# EasyEDA Pro project STM32H723ZGTx_ADDA.eprj, board PCB1
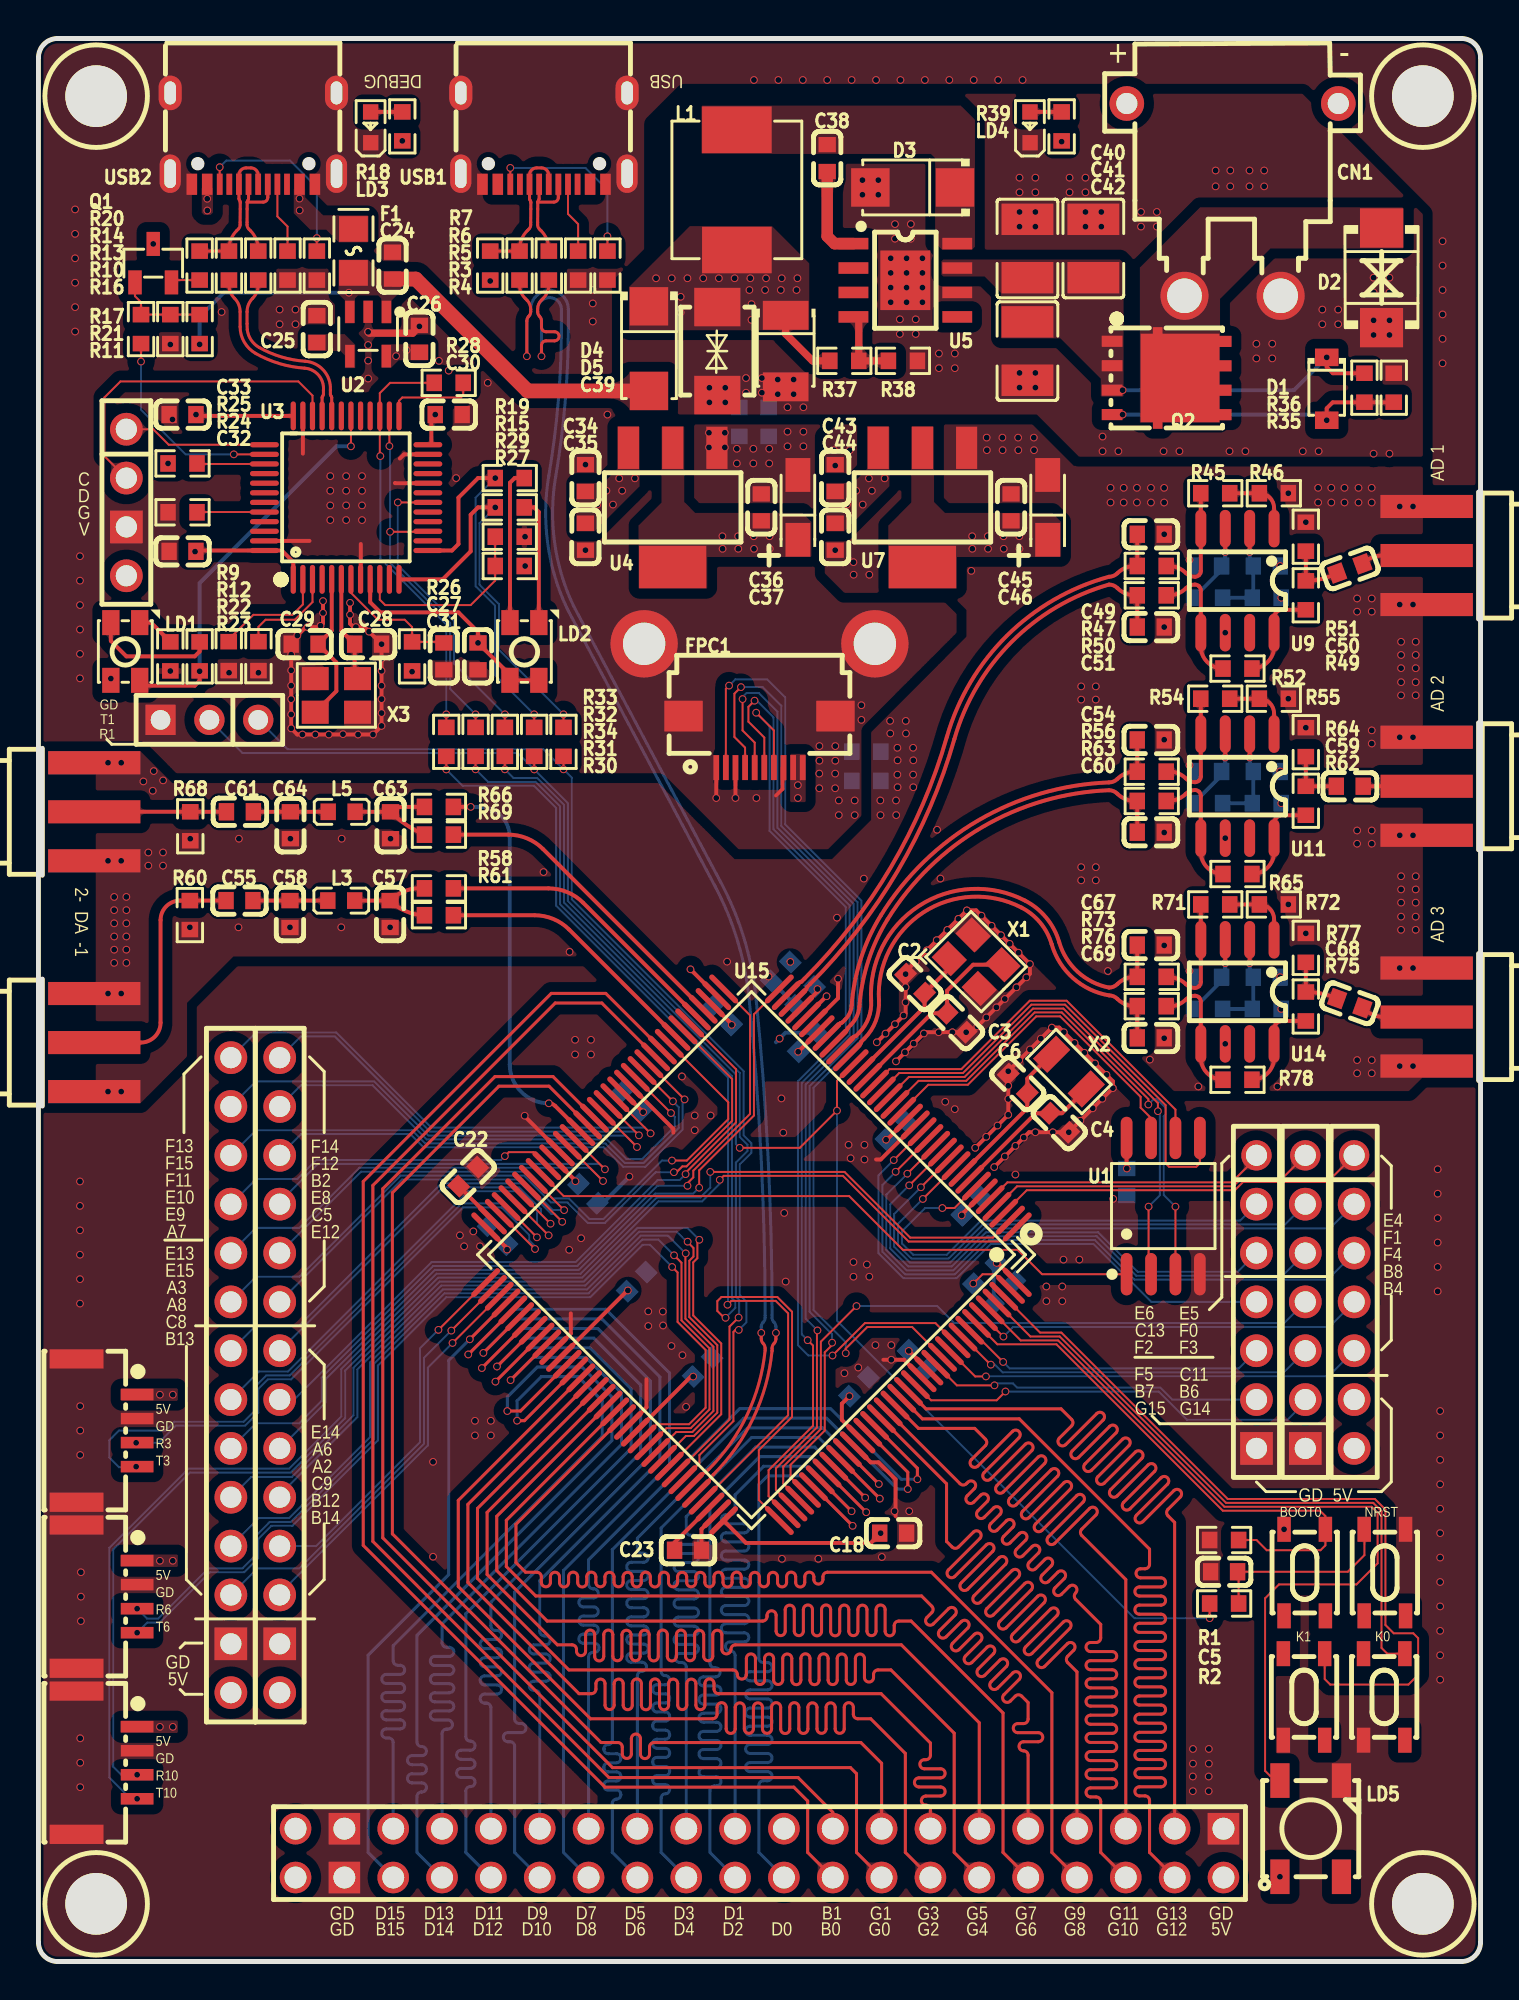
[diagram p5: board, top side]
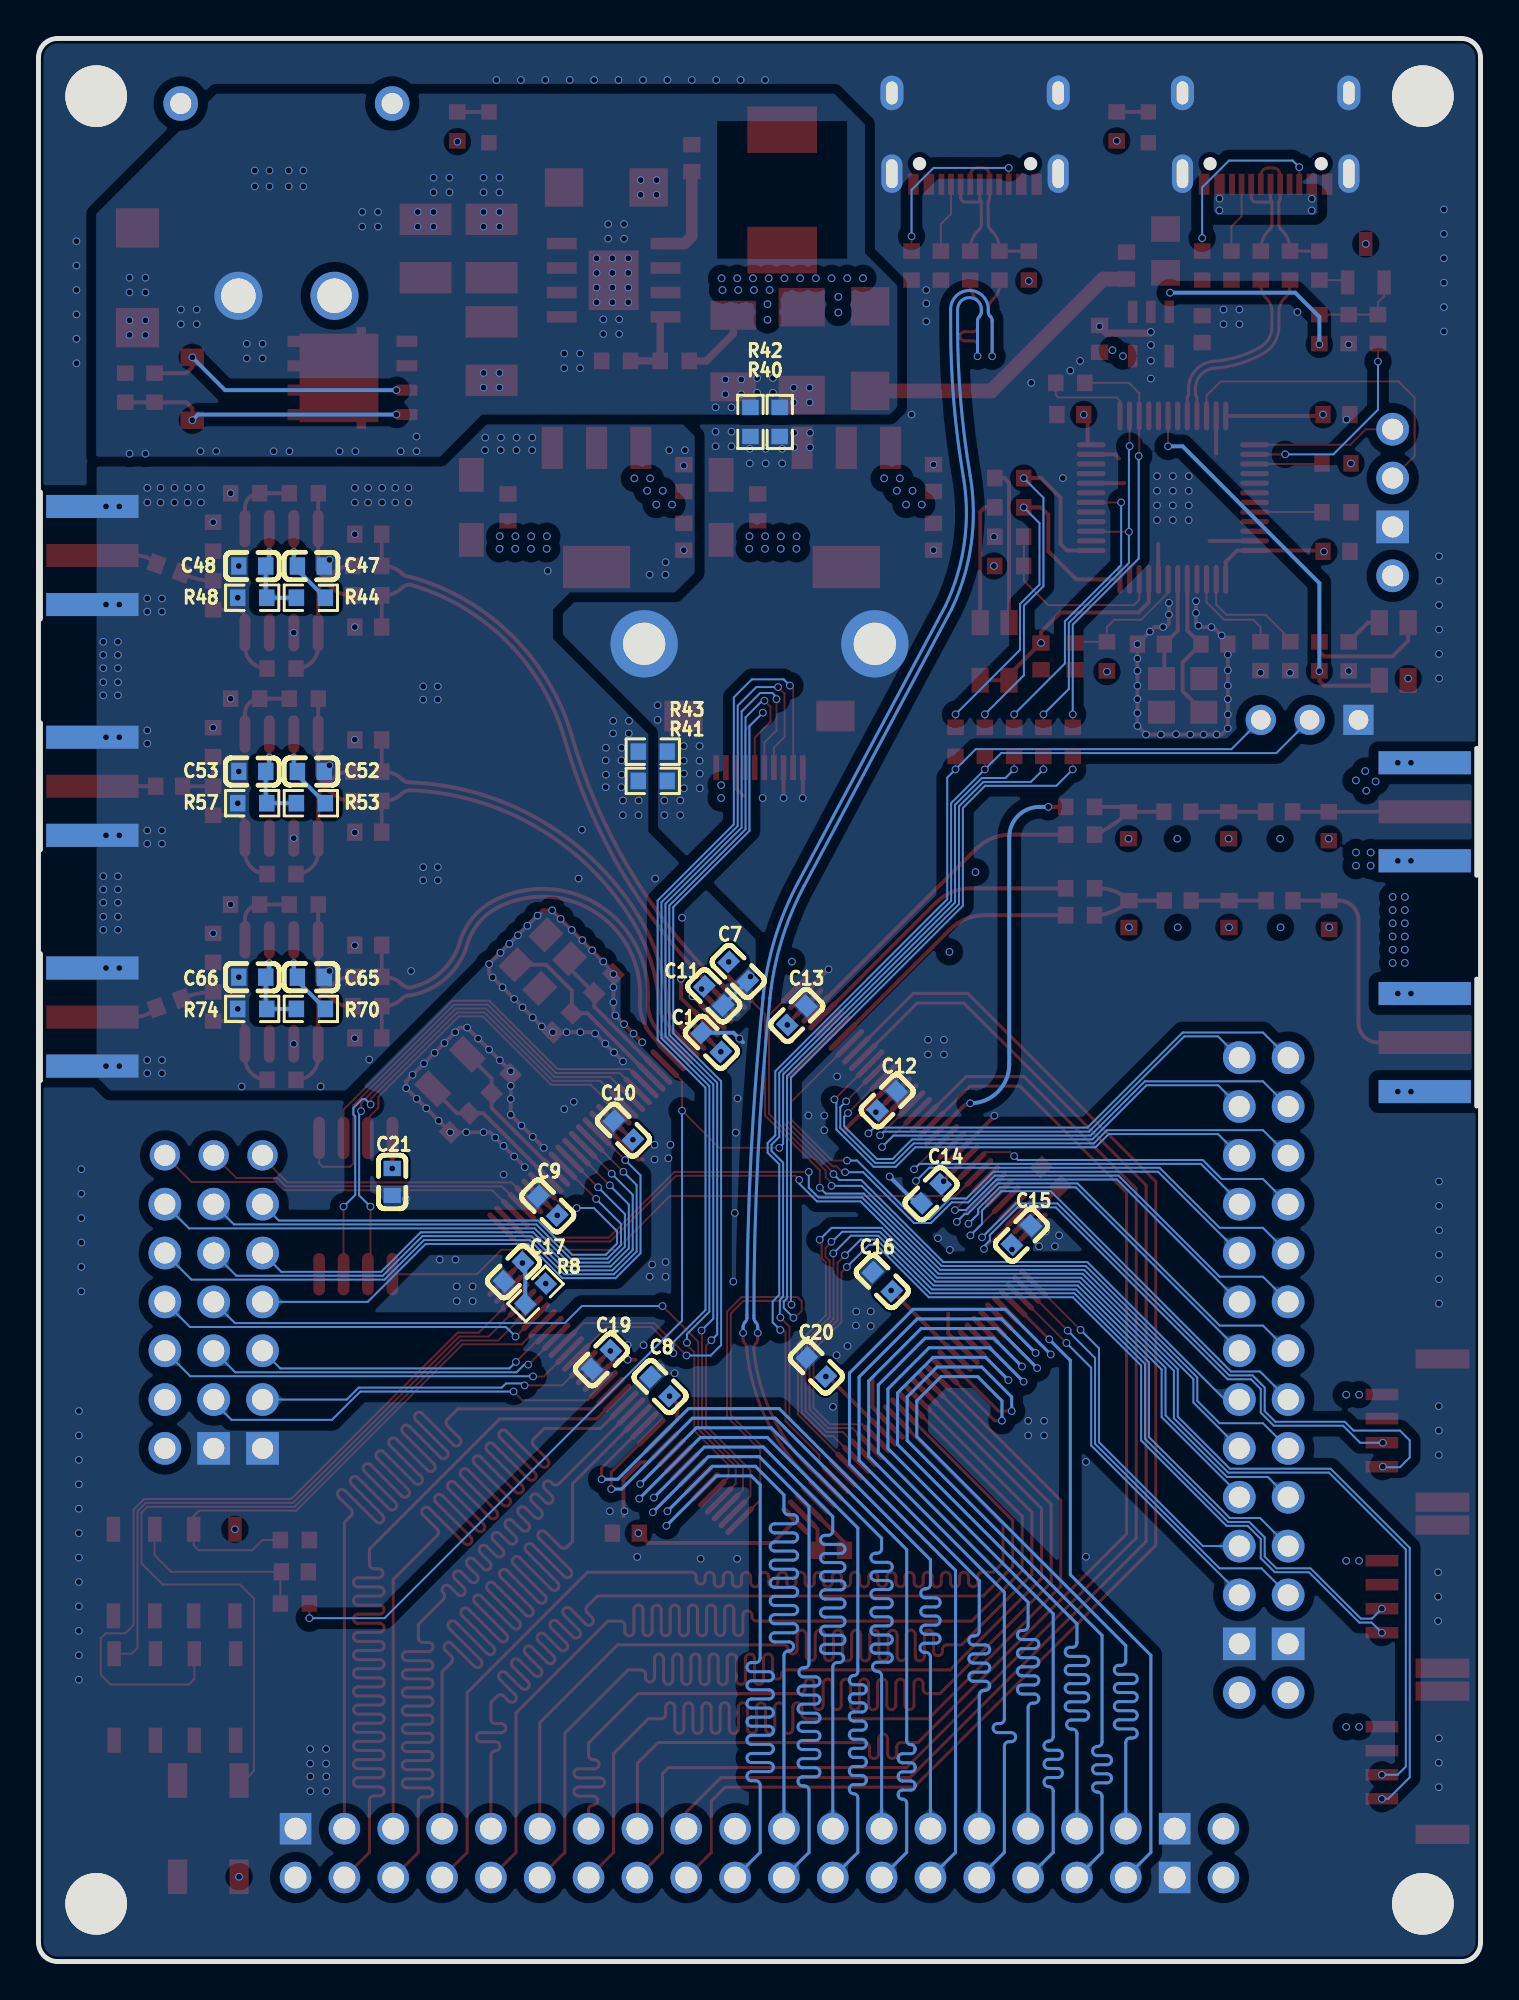
[diagram p6: board, bottom side, seen from below]

Outline 75 x 100 mm; copper layers: Top Layer, GND, PWR, Bottom Layer. Coordinates in mm from the lower left corner of the outline.
Outline path: 0,99 0,1 arc(0.29,0.29) 1,0 74,0 arc(74.71,0.29) 75,1 75,99 arc(74.71,99.71) 74,100 1,100 arc(0.29,99.71) 0,99
Stack: Top Layer 0.035mm 外层铜厚1oz / Dielectric1 0.0994mm 3313 RC57% 4.2mil / GND 0.0152mm 内层铜厚 / Dielectric2 1.265mm 1.3mm H/HOZ Copper / PWR 0.0152mm 内层铜厚 / Dielectric3 0.0994mm 3313 RC57% 4.2mil / Bottom Layer 0.035mm 外层铜厚1oz

## Design rules (mm)
net PA12: DP2
net LK_USB_M: DP3
net LK_USB_P: DP3
net PA11: DP2
net DA0: ADC
net DA1: ADC
net DB8: DAC
net DB9: DAC
net DB10: DAC
net DB11: DAC
net DB12: DAC
net DB13: DAC
net DA2: ADC
net DA3: ADC
net DA4: ADC
net DA5: ADC
net DA6: ADC
net DA7: ADC
net DA8: ADC
net DB0: DAC
net DB1: DAC
net DB2: DAC
net DB3: DAC
net DB4: DAC
net DB5: DAC
net DB6: DAC
net DB7: DAC
net DA9: ADC
net DA10: ADC
net DA11: ADC
net DA12: ADC
net DA13: ADC
net DA14: ADC
net DA15: ADC
net ADC_CLK: ADC
net DAC_CLK: DAC
net ADC_DCO: ADC
net ADC2_INP10: DP8
net ADC2_INN10: DP8
net ADC3_INN1: DP7
net ADC3_INP1: DP7
net ADC1_INP16: DP6
net ADC1_INN16: DP6
net DAOF: ADC
template: 自定义配置
spacing copperThickness1oz (default): track to track 0.102, other pairs 0.152 to 0.3
spacing copperThickness2oz: track to track 0.203, other pairs 0.152 to 0.3
spacing ADDA: track to track 0.315, other pairs 0.152 to 0.3
track width copperThickness1oz (default): min 0.102, default 0.102, max 2.54
track width copperThickness2oz: min 0.203, default 0.203, max 2.54
track width 50om: min 0.127, default 0.157, max 2.54
track width VDD: min 0.102, default 0.203, max 2.54
differential pair differentialPair (default): width min 0.127, default 0.203, max 2.54; gap min 0.152, default 0.203
differential pair USB_90om_df_8mil: width min 0.127, default 0.157, max 2.54; gap min 0.203, default 0.203
via viaSize (default): diameter min 0.399, default 0.399, max 10; hole min 0.3, default 0.305, max 6.299
net class ADC uses 50om, ADDA
net class DAC uses 50om, ADDA
net AVDD uses VDD
net AGND uses VDD
net GND uses VDD
net DVDD uses VDD
net LK_3V3 uses VDD
net PA12 uses USB_90om_df_8mil
net LK_USB_M uses USB_90om_df_8mil
net LK_USB_P uses USB_90om_df_8mil
net PA11 uses USB_90om_df_8mil
net DA0 uses 50om, ADC_len, ADDA
net DA1 uses 50om, ADC_len, ADDA
net DB8 uses 50om, ADDA, DAC_len
net DB9 uses 50om, ADDA, DAC_len
net DB10 uses 50om, ADDA, DAC_len
net DB11 uses 50om, ADDA, DAC_len
net DB12 uses 50om, ADDA, DAC_len
net DB13 uses 50om, ADDA, DAC_len
net DA2 uses 50om, ADC_len, ADDA
net DA3 uses 50om, ADC_len, ADDA
net DA4 uses 50om, ADC_len, ADDA
net DA5 uses 50om, ADC_len, ADDA
net DA6 uses 50om, ADC_len, ADDA
net DA7 uses 50om, ADC_len, ADDA
net DA8 uses 50om, ADC_len, ADDA
net DB0 uses 50om, ADDA, DAC_len
net DB1 uses 50om, ADDA, DAC_len
net DB2 uses 50om, ADDA, DAC_len
net DB3 uses 50om, ADDA, DAC_len
net DB4 uses 50om, ADDA, DAC_len
net DB5 uses 50om, ADDA, DAC_len
net DB6 uses 50om, ADDA, DAC_len
net DB7 uses 50om, ADDA, DAC_len
net DA9 uses 50om, ADC_len, ADDA
net DA10 uses 50om, ADC_len, ADDA
net DA11 uses 50om, ADC_len, ADDA
net DA12 uses 50om, ADC_len, ADDA
net DA13 uses 50om, ADC_len, ADDA
net DA14 uses 50om, ADC_len, ADDA
net DA15 uses 50om, ADC_len, ADDA
net ADC_CLK uses 50om, ADDA
net DAC_CLK uses 50om, ADDA
net ADC_DCO uses 50om, ADDA
net DAOF uses 50om, ADDA
diff pair DP2 uses USB_90om_df_8mil
diff pair DP3 uses USB_90om_df_8mil
eq len grp ADC_DATA uses ADC_len
eq len grp DAC_DATA uses DAC_len

## Placement (name value [footprint] x y rotation side)
C1  100nF  [C0603]  39.88 50.22 45 bottom
C2  22pF  [C0603]  45.59 50.85 135 top
C3  22pF  [C0603]  47.75 48.82 315 top
C4  22pF  [C0603]  53.09 43.62 135 top
C5  100nF  [C0603]  61.66 20.27 0 top
C6  22pF  [C0603]  50.93 45.65 315 top
C7  100nF  [C0603]  38.61 51.49 45 bottom
C8  100nF  [C0603]  42.67 29.9 225 bottom
C9  100nF  [C0603]  48.51 39.29 225 bottom
C10  100nF  [C0603]  44.58 43.23 225 bottom
C11  100nF  [C0603]  40 47.8 225 bottom
C12  100nF  [C0603]  30.86 44.75 315 bottom
C13  100nF  [C0603]  35.56 49.2 315 bottom
C14  100nF  [C0603]  28.57 39.93 135 bottom
C15  100nF  [C0603]  23.88 37.77 315 bottom
C16  100nF  [C0603]  31.12 35.36 225 bottom
C17  100nF  [C0603]  50.29 35.86 135 bottom
C18  100nF  [C0603]  44.45 22.28 180 top
C19  100nF  [C0603]  45.72 31.29 135 bottom
C20  1uF  [C0603]  34.54 30.91 225 bottom
C21  100nF  [C0603]  56.6 40.54 90 bottom
C22  2.2uF  [C0603]  22.35 40.82 45 top
C23  2.2uF  [C0603]  33.78 21.39 0 top
C24  1uF  [C0603]  18.41 88.19 270 top
C25  22nF  [C0603]  14.48 84.89 270 top
C26  1uF  [C0603]  19.81 84.38 270 top
C27  100nF  [C0603]  21.08 67.87 90 top
C28  22pF  [C0603]  17.14 68.5 0 top
C29  22pF  [C0603]  13.84 68.5 180 top
C30  100nF  [C0603]  21.34 80.44 180 top
C31  100nF  [C0603]  22.86 67.87 90 top
C32  100nF  [C0603]  7.49 73.33 0 top
C33  100nF  [C0603]  7.49 80.44 0 top
C34  100nF  [C0603]  28.45 77.14 270 top
C35  1uF  [C0603]  28.45 74.09 90 top
C36  1uF  [C0603]  37.59 75.62 270 top
C37  10uF  [CAP-SMD_L3.2-W1.6-RD-C7171]  39.5 75.62 90 top
C38  10nF  [C0603]  41.02 93.78 270 top
C39  220uF  [CASE-B_3528]  38.86 83.74 270 top
C40  4.7uF  [C1210]  51.44 89.08 270 top
C41  4.7uF  [C1210]  54.86 89.08 270 top
C42  4.7uF  [C1210]  51.44 83.74 90 top
C43  100nF  [C0603]  41.44 77.14 270 top
C44  1uF  [C0603]  41.44 74.09 90 top
C45  1uF  [C0603]  50.58 75.62 270 top
C46  10uF  [CAP-SMD_L3.2-W1.6-RD-C7171]  52.49 75.62 90 top
C47  100nF  [C0603]  60.83 72.57 0 bottom
C48  100nF  [C0603]  63.88 72.57 0 bottom
C49  100nF  [C0603]  57.85 74.22 180 top
C50  100nF  [C0603]  68.2 72.44 200 top
C51  100nF  [C0603]  57.85 69.39 180 top
C52  100nF  [C0603]  60.83 61.88 0 bottom
C53  100nF  [C0603]  63.88 61.88 0 bottom
C54  100nF  [C0603]  57.85 63.52 180 top
C55  104  [C0603]  10.45 55.17 180 top
C57  110p  [C0603]  18.29 54.47 90 top
C58  120p  [C0603]  13.08 54.47 90 top
C59  100nF  [C0603]  68.2 61.12 180 top
C60  100nF  [C0603]  57.85 58.72 180 top
C61  104  [C0603]  10.48 59.79 180 top
C63  110p  [C0603]  18.31 59.09 90 top
C64  120p  [C0603]  13.1 59.09 90 top
C65  100nF  [C0603]  60.83 51.19 0 bottom
C66  100nF  [C0603]  63.88 51.19 0 bottom
C67  100nF  [C0603]  57.85 52.86 180 top
C68  100nF  [C0603]  68.2 49.83 160 top
C69  100nF  [C0603]  57.85 48.03 180 top
CN1  XT30PW-M30.G.Y  [CONN-TH_XT30PW-M]  62.1 91.62 180 top
D1  BZT52C9V1  [SOD-123_L2.7-W1.6-LS3.7-RD]  67 81.78 270 top
D2  SMBJ24CA  [SMB_L4.6-W3.6-LS5.4-BI]  69.85 87.55 90 top
D3  B340A  [SMA_L4.3-W2.6-LS5.1-RD]  45.47 92.25 180 top
D4  B340A  [SMA_L4.3-W2.6-LS5.1-RD]  31.75 83.87 270 top
D5  SMBJ5.0CA  [SMB_L4.5-W3.6-LS5.2-BI]  35.31 83.74 90 top
F1  BSMD0805-100-6V  [F0805]  16.38 88.95 270 top
FPC1  AFC01-S10FCA-00  [FPC-SMD_P0.5-10P_FGS-XJ-H2.0]  37.5 63.42 0 top
H1  -  [HDR-TH_4P-P2.54-V-F]  4.57 75.87 270 top
H2  -  [HDR-TH_3P-P2.54-V-F]  8.89 64.57 180 top
H3  -  [HDR-TH_14P-P2.54-V-F-1]  10.01 30.49 270 top
H4  -  [HDR-TH_14P-P2.54-V-F-1]  12.55 30.49 270 top
H5  -  [HDR-TH_7P-P2.54-V-F#2]  63.35 34.3 270 top
H6  -  [HDR-TH_7P-P2.54-V-F#2]  65.89 34.3 270 top
H7  -  [HDR-TH_7P-P2.54-V-F]  68.43 34.3 270 top
L1  22uH  [IND-SMD_L7.0-W6.6_FXL0630]  36.32 92.13 270 top
L3  300n  [L0603]  15.75 55.17 180 top
L5  300n  [L0603]  15.77 59.79 180 top
LD1  XL-3528SURUGC  [LED-SMD_4P-L3.2-W2.8-LS3.5-TL]  4.52 68.12 270 top
LD2  XL-3528SURUGC  [LED-SMD_4P-L3.2-W2.8-LS3.5-TL]  25.27 68.12 270 top
LD3  -  [LED_0603]  17.27 95.43 90 top
LD4  -  [LED_0603]  51.56 95.43 90 top
LD5  WS2812B-V5/W  [LED-SMD_4P-L5.0-W5.0-TL-1]  66.17 6.91 90 top
NOREF  -  [Pad_e3]  43.5 68.52 180 top
NOREF#2  -  [Pad_e10]  31.5 68.52 180 top
Q1  MMS8050-H-TP  [SOT-23-3_L2.9-W1.3-P1.90-LS2.4-BR]  5.97 88.32 270 top
Q2  HYG110P04LQ2C2  [PDFN-8_L5.2-W5.9-P1.27-LS6.2-BL]  58.67 82.35 270 top
R1  10K  [R0603]  61.66 21.92 180 top
R2  10K  [R0603]  61.66 18.62 180 top
R3  5.1K  [R0603]  28.07 88.19 90 top
R4  5.1K  [R0603]  29.59 88.19 90 top
R5  22R  [R0603]  26.54 88.19 90 top
R6  22R  [R0603]  25.02 88.19 90 top
R7  1.5K  [R0603]  23.5 88.19 90 top
R8  10K  [R0603]  49.15 34.72 315 bottom
R9  100R  [R0603]  6.86 67.87 90 top
R10  5.1K  [R0603]  12.95 88.19 90 top
R11  10K  [R0603]  8.38 84.89 270 top
R12  100R  [R0603]  8.38 67.87 90 top
R13  22R  [R0603]  11.43 88.19 270 top
R14  22R  [R0603]  9.91 88.19 270 top
R15  100R  [R0603]  24.51 75.62 0 top
R16  5.1K  [R0603]  14.48 88.19 90 top
R17  100R  [R0603]  5.33 84.89 270 top
R18  1K  [R0603]  18.92 95.43 90 top
R19  100R  [R0603]  24.51 77.14 0 top
R20  1.5K  [R0603]  8.38 88.19 270 top
R21  36K  [R0603]  6.86 84.89 90 top
R22  10K  [R0603]  9.89 67.88 270 top
R23  10K  [R0603]  11.44 67.88 270 top
R24  100K  [R0603]  7.49 75.36 0 top
R25  4.7K  [R0603]  7.49 77.9 180 top
R26  100K  [R0603]  19.43 67.87 270 top
R27  4.7K  [R0603]  24.51 72.57 0 top
R28  100R  [R0603]  21.34 82.09 0 top
R29  4.7K  [R0603]  24.51 74.09 180 top
R30  22R  [R0603]  27.31 63.42 270 top
R31  22R  [R0603]  25.78 63.42 270 top
R32  22R  [R0603]  22.73 63.42 270 top
R33  22R  [R0603]  21.21 63.42 270 top
R34  22R  [R0603]  24.26 63.42 270 top
R35  10K  [R0603]  70.49 81.84 270 top
R36  10K  [R0603]  68.96 81.84 90 top
R37  10K 0.1%  [R0603]  41.91 83.24 180 top
R38  3.24K 0.1%  [R0603]  44.96 83.24 180 top
R39  1K  [R0603]  53.21 95.43 90 top
R40  0R  [R0603]  37.97 80.06 270 bottom
R41  0R  [R0603]  43.05 61.39 0 bottom
R42  0R  [R0603]  36.45 80.06 270 bottom
R43  0R  [R0603]  43.05 62.92 0 bottom
R44  10K 0.1%  [R0603]  60.83 70.92 180 bottom
R45  499R  [R0603]  61.2 76.35 180 top
R46  523R  [R0603]  64.25 76.35 180 top
R47  49.9R  [R0603]  57.9 72.57 180 top
R48  10K 0.1%  [R0603]  63.88 70.92 180 bottom
R49  499R  [R0603]  65.91 71.04 270 top
R50  49.9R  [R0603]  57.9 71.04 180 top
R51  49.9R  [R0603]  65.91 74.09 270 top
R52  499R  [R0603]  62.36 67.23 180 top
R53  10K 0.1%  [R0603]  60.83 60.23 180 bottom
R54  499R  [R0603]  61.2 65.67 180 top
R55  523R  [R0603]  64.25 65.67 180 top
R56  49.9R  [R0603]  57.9 61.87 180 top
R57  10K 0.1%  [R0603]  63.88 60.23 180 bottom
R58  50  [R0603]  20.83 55.8 180 top
R60  51  [R0603]  7.87 54.42 90 top
R61  50  [R0603]  20.83 54.41 180 top
R62  499R  [R0603]  65.91 60.36 270 top
R63  49.9R  [R0603]  57.9 60.35 180 top
R64  49.9R  [R0603]  65.91 63.41 270 top
R65  499R  [R0603]  62.36 56.55 180 top
R66  50  [R0603]  20.83 60.04 180 top
R68  51  [R0603]  7.9 59.03 90 top
R69  50  [R0603]  20.83 58.6 180 top
R70  10K 0.1%  [R0603]  60.83 49.54 180 bottom
R71  499R  [R0603]  61.2 54.97 180 top
R72  523R 0.1%  [R0603]  64.25 54.97 180 top
R73  49.9R 0.1%  [R0603]  57.9 51.2 180 top
R74  10K 0.1%  [R0603]  63.88 49.54 180 bottom
R75  499R 0.1%  [R0603]  65.91 49.66 270 top
R76  49.9R 0.1%  [R0603]  57.9 49.68 180 top
R77  49.9R 0.1%  [R0603]  65.91 52.71 270 top
R78  499R 0.1%  [R0603]  62.36 45.85 180 top
RF1  BWSMA-KE-P001  [SMA-SMD_BWSMA-KE-P001]  72.2 73.11 0 top
RF2  BWSMA-KE-P001  [SMA-SMD_BWSMA-KE-P001]  2.9 47.79 180 top
RF3  BWSMA-KE-P001  [SMA-SMD_BWSMA-KE-P001]  72.2 61.11 0 top
RF4  BWSMA-KE-P001  [SMA-SMD_BWSMA-KE-P001]  2.9 59.79 180 top
RF5  BWSMA-KE-P001  [SMA-SMD_BWSMA-KE-P001]  72.2 49.11 0 top
SW1  K2-1808SN-A3SW-01  [SW-SMD_4P-L4.2-W3.3-P2.15-LS5.1]  65.86 20.23 90 top
SW2  K2-1808SN-A3SW-01  [SW-SMD_4P-L4.2-W3.3-P2.15-LS5.1]  70.02 20.23 90 top
SW3  K2-1808SN-A3SW-01  [SW-SMD_4P-L4.2-W3.3-P2.15-LS5.1]  69.99 13.76 270 top
SW4  K2-1808SN-A3SW-01  [SW-SMD_4P-L4.2-W3.3-P2.15-LS5.1]  65.82 13.76 270 top
TP1  M3铜柱  [M3铜柱_LCEDA]  3 97 0 top
TP2  M3铜柱  [M3铜柱_LCEDA]  3 3 0 top
TP3  M3铜柱  [M3铜柱_LCEDA]  72 97 0 top
TP4  M3铜柱  [M3铜柱_LCEDA]  72 3 0 top
U1  W25Q64JVSSIQ  [SOP-8_L5.3-W5.3-P1.27-LS8.0-BL]  58.5 39.28 0 top
U2  RT9193-33GB  [SOT-23-5_L3.0-W1.7-P0.95-LS2.8-BL]  17.14 84.63 180 top
U3  STM32F103CBT6  [LQFP-48_L7.0-W7.0-P0.50-LS9.0-BL]  16 76.12 0 top
U4  TLV1117LV33DCYR  [SOT-223_L6.7-W3.5-P2.30-BR]  32.99 75.62 90 top
U5  TPS5430QDDARQ1  [SOPOWERPAD-8_L4.9-W3.9-P1.27-LS6.0-BL-EP]  45.09 87.43 270 top
U7  TLV1117LV33DCYR  [SOT-223_L6.7-W3.5-P2.30-BR]  45.97 75.62 90 top
U8  PZ254V-12-40P  [HDR-TH_40P-P2.54-V-M-R2-C20-S2.54_2-146257-0]  37.5 5.64 180 top
U9  AD8138ARZ-RL  [SOIC-8_L5.0-W4.0-P1.27-LS6.0-BL]  62.36 71.81 180 top
U10  WAFER-GH1.25-4PWB  [CONN-SMD_4P-P1.25_XUNPU_WAFER-GH1.25-4PWB]  3.56 27.61 270 top
U11  AD8138ARZ-RL  [SOIC-8_L5.0-W4.0-P1.27-LS6.0-BL]  62.36 61.12 180 top
U12  WAFER-GH1.25-4PWB  [CONN-SMD_4P-P1.25_XUNPU_WAFER-GH1.25-4PWB]  3.56 18.97 270 top
U13  WAFER-GH1.25-4PWB  [CONN-SMD_4P-P1.25_XUNPU_WAFER-GH1.25-4PWB]  3.56 10.34 270 top
U14  AD8138ARZ-RL  [SOIC-8_L5.0-W4.0-P1.27-LS6.0-BL]  62.36 50.42 180 top
U15  STM32H723ZGTx  [LQFP-144_L20.0-W20.0-P0.50-LS22.0-BL]  37.08 36.75 135 top
USB1  TYPE-C 16PIN 2MD(073)  [USB-C-SMD_TYPE-C-6PIN-2MD-073]  26.29 94.79 180 top
USB2  TYPE-C 16PIN 2MD(073)  [USB-C-SMD_TYPE-C-6PIN-2MD-073]  11.18 94.79 180 top
X1  25MHz  [OSC-SMD_4P-L3.2-W2.5-BL]  48.77 51.99 315 top
X2  32.768KHz  [OSC-SMD_L3.2-W1.5]  53.59 46.28 315 top
X3  8MHz  [OSC-SMD_4P-L3.2-W2.5-BL]  15.49 65.84 180 top

## Footprints (pads in the part's own frame, mm; a bottom-side part is the same pattern mirrored in y, then rotated)
C0603
  rect 0.8x0.9 smd: 1(-0.7,0) 2(0.7,0)
C1210
  rect 1.635x2.7 smd: 1(-1.518,0) 2(1.518,0)
CAP-SMD_L3.2-W1.6-RD-C7171
  rect 1.758x1.296 smd: 1(-1.687,0) 2(1.687,0)
CASE-B_3528
  rect 1.506x2.376 smd: 1(-1.861,0) 2(1.861,0)
CONN-SMD_4P-P1.25_XUNPU_WAFER-GH1.25-4PWB
  rect 0.6x1.7 smd: 1(-1.875,1.575) 2(-0.625,1.575) 3(0.625,1.575) 4(1.875,1.575)
  rect 1x2.8 smd: 5(3.725,-1.575) 6(-3.725,-1.575)
CONN-TH_XT30PW-M
  round 2.5 hole 1.8: 1(-2.5,5) 2(2.5,5)
  round 1.8 hole 1.1: 3(5.5,-5) 4(-5.5,-5)
F0805
  rect 1.335x1.5 smd: 1(-1.143,0) 2(1.143,0)
FPC-SMD_P0.5-10P_FGS-XJ-H2.0
  rect 0.3x1.3 smd: 1(-2.25,-1.339) 2(-1.75,-1.339) 3(-1.25,-1.34) 4(-0.75,-1.339) 5(-0.25,-1.34) 6(0.25,-1.339) 7(0.75,-1.339) 8(1.25,-1.339) 9(1.75,-1.339) 10(2.25,-1.34)
  rect 2x1.6 smd: 11(3.95,1.34) 12(-3.95,1.34)
HDR-TH_3P-P2.54-V-F
  round 1.575 hole 1.02: 1(-2.54,0) 2(0,0)
  rect 1.575x1.575 hole 1.02: 3(2.54,0)
HDR-TH_4P-P2.54-V-F
  round 1.7 hole 1.1: 1(-3.81,0) 2(-1.27,0) 4(3.81,0)
  rect 1.7x1.7 hole 1.1: 3(1.27,0)
HDR-TH_7P-P2.54-V-F
  round 1.575 hole 1.1: 1(-7.62,0)
  round 1.7 hole 1.1: 2(-5.08,0) 3(-2.54,0) 4(0,0) 5(2.54,0) 6(5.08,0) 7(7.62,0)
HDR-TH_7P-P2.54-V-F#2
  round 1.575 hole 1.1: 1(-7.62,0)
  round 1.7 hole 1.1: 2(-5.08,0) 3(-2.54,0) 4(0,0) 5(2.54,0) 6(5.08,0)
  rect 1.7x1.7 hole 1.1: 7(7.62,0)
HDR-TH_14P-P2.54-V-F-1
  round 1.7 hole 1.1: 1(-16.51,0) 2(-13.97,0) 3(-11.43,0) 4(-8.89,0) 5(-6.35,0) 6(-3.81,0) 7(-1.27,0) 8(1.27,0) 9(3.81,0) 10(6.35,0) 11(8.89,0) 12(11.43,0) 14(16.51,0)
  rect 1.7x1.7 hole 1.1: 13(13.97,0)
HDR-TH_40P-P2.54-V-M-R2-C20-S2.54_2-146257-0
  rect 1.64x1.64 hole 1.14: 1(-24.13,-1.27) 37(21.59,-1.27) 38(21.59,1.27)
  round 1.64 hole 1.14: 2(-24.13,1.27) 3(-21.59,-1.27) 4(-21.59,1.27) 5(-19.05,-1.27) 6(-19.05,1.27) 7(-16.51,-1.27) 8(-16.51,1.27) 9(-13.97,-1.27) 10(-13.97,1.27) 11(-11.43,-1.27) 12(-11.43,1.27) 13(-8.89,-1.27) 14(-8.89,1.27) 15(-6.35,-1.27) 16(-6.35,1.27) 17(-3.81,-1.27) 18(-3.81,1.27) 19(-1.27,-1.27) 20(-1.27,1.27) 21(1.27,-1.27) 22(1.27,1.27) 23(3.81,-1.27) 24(3.81,1.27) 25(6.35,-1.27) 26(6.35,1.27) 27(8.89,-1.27) 28(8.89,1.27) 29(11.43,-1.27) 30(11.43,1.27) 31(13.97,-1.27) 32(13.97,1.27) 33(16.51,-1.27) 34(16.51,1.27) 35(19.05,-1.27) 36(19.05,1.27) 39(24.13,-1.27) 40(24.13,1.27)
IND-SMD_L7.0-W6.6_FXL0630
  rect 2.424x3.62 smd: 1(3.128,0) 2(-3.128,0)
L0603
  rect 0.8x0.864 smd: 1(-0.7,0) 2(0.7,0)
LED-SMD_4P-L3.2-W2.8-LS3.5-TL
  rect 1.3x0.9 smd: 1(-1.5,0.75) 2(1.5,0.75) 3(-1.5,-0.75) 4(1.5,-0.75)
LED-SMD_4P-L5.0-W5.0-TL-1
  rect 1.8x1 smd: 1(-2.5,1.6) 2(-2.5,-1.6) 3(2.5,-1.6) 4(2.5,1.6)
LED_0603
  rect 0.8x0.8 smd: 1(-0.851,-0.01) 2(0.75,-0.005)
LQFP-48_L7.0-W7.0-P0.50-LS9.0-BL
  oval 0.27x1.5 smd: 1(-2.75,-4.25) 2(-2.25,-4.25) 3(-1.75,-4.25) 4(-1.25,-4.25) 5(-0.75,-4.25) 6(-0.25,-4.25) 7(0.25,-4.25) 8(0.75,-4.25) 9(1.25,-4.25) 10(1.75,-4.25) 11(2.25,-4.25) 12(2.75,-4.25) 25(2.75,4.25) 26(2.25,4.25) 27(1.75,4.25) 28(1.25,4.25) 29(0.75,4.25) 30(0.25,4.25) 31(-0.25,4.25) 32(-0.75,4.25) 33(-1.25,4.25) 34(-1.75,4.25) 35(-2.25,4.25) 36(-2.75,4.25)
  oval 1.5x0.27 smd: 13(4.25,-2.75) 14(4.25,-2.25) 15(4.25,-1.75) 16(4.25,-1.25) 17(4.25,-0.75) 18(4.25,-0.25) 19(4.25,0.25) 20(4.25,0.75) 21(4.25,1.25) 22(4.25,1.75) 23(4.25,2.25) 24(4.25,2.75) 37(-4.25,2.75) 38(-4.25,2.25) 39(-4.25,1.75) 40(-4.25,1.25) 41(-4.25,0.75) 42(-4.25,0.25) 43(-4.25,-0.25) 44(-4.25,-0.75) 45(-4.25,-1.25) 46(-4.25,-1.75) 47(-4.25,-2.25) 48(-4.25,-2.75)
LQFP-144_L20.0-W20.0-P0.50-LS22.0-BL
  oval 0.28x2 smd: 1(-8.75,-10.8) 2(-8.25,-10.8) 3(-7.75,-10.8) 4(-7.25,-10.8) 5(-6.75,-10.8) 6(-6.25,-10.8) 7(-5.75,-10.8) 8(-5.25,-10.8) 9(-4.75,-10.8) 10(-4.25,-10.8) 11(-3.75,-10.8) 12(-3.25,-10.8) 13(-2.75,-10.8) 14(-2.25,-10.8) 15(-1.75,-10.8) 16(-1.25,-10.8) 17(-0.75,-10.8) 18(-0.25,-10.8) 19(0.25,-10.8) 20(0.75,-10.8) 21(1.25,-10.8) 22(1.75,-10.8) 23(2.25,-10.8) 24(2.75,-10.8) 25(3.25,-10.8) 26(3.75,-10.8) 27(4.25,-10.8) 28(4.75,-10.8) 29(5.25,-10.8) 30(5.75,-10.8) 31(6.25,-10.8) 32(6.75,-10.8) 33(7.25,-10.8) 34(7.75,-10.8) 35(8.25,-10.8) 36(8.75,-10.8) 73(8.75,10.8) 74(8.25,10.8) 75(7.75,10.8) 76(7.25,10.8) 77(6.75,10.8) 78(6.25,10.8) 79(5.75,10.8) 80(5.25,10.8) 81(4.75,10.8) 82(4.25,10.8) 83(3.75,10.8) 84(3.25,10.8) 85(2.75,10.8) 86(2.25,10.8) 87(1.75,10.8) 88(1.25,10.8) 89(0.75,10.8) 90(0.25,10.8) 91(-0.25,10.8) 92(-0.75,10.8) 93(-1.25,10.8) 94(-1.75,10.8) 95(-2.25,10.8) 96(-2.75,10.8) 97(-3.25,10.8) 98(-3.75,10.8) 99(-4.25,10.8) 100(-4.75,10.8) 101(-5.25,10.8) 102(-5.75,10.8) 103(-6.25,10.8) 104(-6.75,10.8) 105(-7.25,10.8) 106(-7.75,10.8) 107(-8.25,10.8) 108(-8.75,10.8)
  oval 2x0.28 smd: 37(10.8,-8.75) 38(10.8,-8.25) 39(10.8,-7.75) 40(10.8,-7.25) 41(10.8,-6.75) 42(10.8,-6.25) 43(10.8,-5.75) 44(10.8,-5.25) 45(10.8,-4.75) 46(10.8,-4.25) 47(10.8,-3.75) 48(10.8,-3.25) 49(10.8,-2.75) 50(10.8,-2.25) 51(10.8,-1.75) 52(10.8,-1.25) 53(10.8,-0.75) 54(10.8,-0.25) 55(10.8,0.25) 56(10.8,0.75) 57(10.8,1.25) 58(10.8,1.75) 59(10.8,2.25) 60(10.8,2.75) 61(10.8,3.25) 62(10.8,3.75) 63(10.8,4.25) 64(10.8,4.75) 65(10.8,5.25) 66(10.8,5.75) 67(10.8,6.25) 68(10.8,6.75) 69(10.8,7.25) 70(10.8,7.75) 71(10.8,8.25) 72(10.8,8.75) 109(-10.8,8.75) 110(-10.8,8.25) 111(-10.8,7.75) 112(-10.8,7.25) 113(-10.8,6.75) 114(-10.8,6.25) 115(-10.8,5.75) 116(-10.8,5.25) 117(-10.8,4.75) 118(-10.8,4.25) 119(-10.8,3.75) 120(-10.8,3.25) 121(-10.8,2.75) 122(-10.8,2.25) 123(-10.8,1.75) 124(-10.8,1.25) 125(-10.8,0.75) 126(-10.8,0.25) 127(-10.8,-0.25) 128(-10.8,-0.75) 129(-10.8,-1.25) 130(-10.8,-1.75) 131(-10.8,-2.25) 132(-10.8,-2.75) 133(-10.8,-3.25) 134(-10.8,-3.75) 135(-10.8,-4.25) 136(-10.8,-4.75) 137(-10.8,-5.25) 138(-10.8,-5.75) 139(-10.8,-6.25) 140(-10.8,-6.75) 141(-10.8,-7.25) 142(-10.8,-7.75) 143(-10.8,-8.25) 144(-10.8,-8.75)
M3铜柱_LCEDA
  round 3.2 hole 3.2: 1(0,0)
OSC-SMD_4P-L3.2-W2.5-BL
  rect 1.4x1.2 smd: 1(-1.1,-0.875) 2(1.1,-0.875) 3(1.1,0.875) 4(-1.1,0.875)
OSC-SMD_L3.2-W1.5
  rect 1.05x1.7 smd: 1(-1.275,0) 2(1.275,0)
Pad_e3
  round 3.5 hole 2.2: 1(0,0)
Pad_e10
  round 3.5 hole 2.2: 1(0,0)
PDFN-8_L5.2-W5.9-P1.27-LS6.2-BL
  rect 0.58x1.079 smd: 1(-1.905,-2.834) 2(-0.635,-2.834) 3(0.635,-2.834) 4(1.905,-2.834)
  rect 0.58x1.08 smd: 5(1.91,2.834) 6(0.64,2.834) 7(-0.63,2.834) 8(-1.9,2.834)
  rect 0.95x0.5 smd: 9(-2.169,-0.465) 9(2.169,-0.465)
  rect 4.6x4.1 smd: 9(0,0.695)
R0603
  rect 0.806x0.864 smd: 1(-0.753,0) 2(0.753,0)
SMA-SMD_BWSMA-KE-P001
  rect 4.8x1.2 smd: 1(0,-2.55) 2(0,2.55) 5(0,0)
  rect 4.8x1.2 smd far side: 3(0,2.55) 4(0,-2.55)
SMA_L4.3-W2.6-LS5.1-RD
  rect 2x2 smd: 1(-2.2,0) 2(2.2,0)
SMB_L4.5-W3.6-LS5.2-BI
  rect 2x2.4 smd: 1(-2.288,0) 2(2.288,0)
SMB_L4.6-W3.6-LS5.4-BI
  rect 2.047x2.241 smd: 1(-2.591,0) 2(2.591,0)
SOD-123_L2.7-W1.6-LS3.7-RD
  rect 0.91x1.22 smd: 1(-1.635,0) 2(1.635,0)
SOIC-8_L5.0-W4.0-P1.27-LS6.0-BL
  oval 0.569x1.95 smd: 1(-1.905,-2.705) 2(-0.635,-2.705) 3(0.635,-2.705) 4(1.905,-2.705) 5(1.905,2.705) 6(0.635,2.705) 7(-0.635,2.705) 8(-1.905,2.705)
SOP-8_L5.3-W5.3-P1.27-LS8.0-BL
  oval 0.609x2.204 smd: 1(-1.905,-3.542) 2(-0.635,-3.542) 3(0.635,-3.542) 4(1.905,-3.542) 5(1.905,3.542) 6(0.635,3.542) 7(-0.635,3.542) 8(-1.905,3.542)
SOPOWERPAD-8_L4.9-W3.9-P1.27-LS6.0-BL-EP
  rect 0.6x1.55 smd: 1(-1.905,-2.7) 2(-0.635,-2.7) 3(0.635,-2.7) 4(1.905,-2.7) 5(1.905,2.7) 6(0.635,2.7) 7(-0.635,2.7) 8(-1.905,2.7)
  rect 3.1x2.6 smd: 9(0,0)
SOT-23-3_L2.9-W1.3-P1.90-LS2.4-BR
  rect 1.25x0.7 smd: 1(1,-0.95) 2(1,0.95) 3(-1,0)
SOT-23-5_L3.0-W1.7-P0.95-LS2.8-BL
  rect 0.49x1.157 smd: 1(-0.95,-1.153) 2(0,-1.153) 3(0.95,-1.153)
  rect 0.49x1.175 smd: 4(0.95,1.153) 5(-0.95,1.153)
SOT-223_L6.7-W3.5-P2.30-BR
  rect 2.2x1.1 smd: 1(3.099,-2.3) 2(3.099,0) 3(3.099,2.3)
  rect 2.2x3.5 smd: 4(-3.099,0)
SW-SMD_4P-L4.2-W3.3-P2.15-LS5.1
  rect 1.3x0.7 smd: 1(-2.25,1.075) 2(2.25,1.075) 3(-2.25,-1.075) 4(2.25,-1.075)
USB-C-SMD_TYPE-C-6PIN-2MD-073
  rect 0.55x1.1 smd: 1(-3.2,2.375) 2(-2.4,2.375) 11(2.4,2.375) 12(3.2,2.375)
  rect 0.3x1.1 smd: 3(-1.75,2.375) 4(-1.25,2.375) 5(-0.75,2.375) 6(-0.25,2.375) 7(0.25,2.375) 8(0.75,2.375) 9(1.25,2.375) 10(1.75,2.375)
  oval 1.1x2 hole 0.6x1.5: 13(-4.325,1.825) 14(4.325,1.825)
  oval 1.2x1.8 hole 0.6x1.2: 13(-4.325,-2.375) 14(4.325,-2.375)

## Nets
As in the schematic, except:
GND: C2.2 C3.2 C4.1 C5.1 C6.1 C8.1 C9.1 C10.1 C11.1 C12.1 C13.1 C14.1 C15.1 C16.1 C17.1 C18.1 C19.1 C20.1 C21.1 C22.2 C23.2 C24.1 C25.1 C26.1 C27.1 C28.2 C29.2 C30.1 C31.1 C32.1 C33.1 C34.1 C35.1 C36.1 C37.2 FPC1.1 FPC1.3 FPC1.8 FPC1.11 FPC1.12 H1.3 H2.3 H3.13 H4.13 H5.7 H6.7 LD3.1 LD5.3 NOREF.1 NOREF#2.1 R1.2 R3.1 R4.1 R9.1 R10.1 R16.1 R21.1 R22.2 R23.2 R24.1 R29.1 R40.2 R41.1 R42.2 R43.1 SW2.4 SW3.4 SW4.4 TP1.1 TP2.1 TP3.1 TP4.1 U1.4 U2.2 U3.8 U3.20 U3.23 U3.35 U3.47 U4.1 U8.1 U8.37 U8.38 U10.2 U10.5 U10.6 U12.2 U12.5 U12.6 U13.2 U13.5 U13.6 U15.16 U15.38 U15.51 U15.61 U15.83 U15.94 U15.107 U15.120 U15.130 USB1.1 USB1.12 USB1.13 USB1.14 USB2.1 USB2.12 USB2.13 USB2.14 X1.2 X1.4 X3.2 X3.4

Pads without a net: CN1 3 4; LD5 2; SW1 1 3; SW2 1 3; SW3 2 3; SW4 2 3; U3 4 11 14 16 17 19 21 22 28 29 31 40 41 42 43 45 46; U5 2 3 5; U8 39 40; U9 7; U11 7; U14 7; USB1 2 3 9 11; USB2 3 9

## Via types
v1: diameter 0.399, hole 0.305, Top Layer to Bottom Layer, 778 vias
v2: diameter 0.4, hole 0.305, Top Layer to Bottom Layer, 16 vias

## Routing (per net, layer and track width the routed paths; a pad name or vN(x,y) marks a point on that pad's centre or on a via; arc(x,y) is an arc through that point)
AGND: length 4.9
  Top Layer w0.203: U15.31 41.58,50.09 v1(41.58,51.11)
  Bottom Layer w0.203: v1(37.97,51.22) 37.97,51.13 39.38,49.72
  vias: v1(3.62,62.34) v1(3.62,57.24) v1(3.62,50.34) v1(3.62,45.24) v1(3.94,55.36) v1(3.94,54.67) v1(3.94,53.99) v1(3.94,53.3) v1(3.94,52.62) v1(3.94,51.93) v1(4.3,62.34) v1(4.3,57.24) v1(4.3,50.34) v1(4.3,45.24) v1(4.57,55.36) v1(4.57,54.67) v1(4.57,53.99) v1(4.57,53.3) v1(4.57,52.62) v1(4.57,51.93) v1(5.46,61.36) v1(5.72,57.67) v1(5.72,56.98) v1(5.94,60.88) v1(6,61.9) v1(6.48,61.42) v1(6.48,57.67) v1(6.48,56.98) v1(7.9,58.39) v1(7.87,53.78) v1(10.42,58.39) v1(10.4,53.78) v1(13.1,58.39) v1(13.08,53.78) v1(15.75,53.78) v1(15.77,58.39) v1(18.31,58.39) v1(18.29,53.78) v1(26.27,56.65) v1(27.62,52.5) v1(35.81,51.99) v1(41.38,78.59) v1(41.44,77.79) v1(41.44,73.39) v1(41.53,54.28) v1(42.2,78.59) v1(42.39,72.77) v1(42.4,72.11) v1(42.93,56.31) v1(43.21,72.11) v1(43.78,60.38) v1(43.79,59.61) v1(44.29,64.51) v1(44.3,63.86) v1(44.6,60.38) v1(44.61,59.61) v1(44.67,63.12) v1(44.68,62.46) v1(44.67,61.72) v1(44.68,61.07) v1(45.11,64.51) v1(45.12,63.86) v1(45.49,63.12) v1(45.5,62.46) v1(45.49,61.72) v1(45.5,61.07) v1(46.74,58.85) v1(46.91,56.31) v1(48.51,72.31) v1(49.32,79.24) v1(49.33,78.59) v1(50.13,79.24) v1(50.14,78.59) v1(50.95,79.24) v1(50.96,78.59) v1(51.77,79.24) v1(51.78,78.59) v1(54.23,66.31) v1(54.23,65.62) v1(54.23,56.91) v1(54.23,56.22) v1(54.99,66.31) v1(54.99,65.62) v1(54.99,56.91) v1(54.99,56.22) v1(55.62,51.51) v1(55.76,76.63) v1(55.76,75.87) v1(56.44,76.63) v1(56.44,75.87) v1(57.13,76.63) v1(57.13,75.87) v1(57.8,46.9) v1(57.86,76.63) v1(57.86,75.87) v1(58.54,76.63) v1(58.54,75.87) v1(58.55,74.22) v1(58.55,69.39) v1(58.55,63.53) v1(58.55,58.71) v1(58.55,52.84) v1(58.55,48.01) v1(59.86,72.89) v1(59.86,62.2) v1(59.86,51.51) v1(60.32,45.5) v1(61.72,69.1) v1(61.72,58.42) v1(61.72,47.72) v1(64.43,45.5) v1(64.58,72.57) v1(64.63,70.92) v1(64.58,61.88) v1(64.63,60.23) v1(64.58,51.19) v1(64.63,49.54) v1(65,76.35) v1(65,65.67) v1(65,54.97) v1(65.91,74.85) v1(65.91,64.16) v1(65.91,53.46) v1(66.55,76.63) v1(66.55,75.87) v1(67.24,76.63) v1(67.24,75.87) v1(67.92,76.63) v1(67.92,75.87) v1(68.58,70.88) v1(68.58,70.19) v1(68.58,58.81) v1(68.58,58.13) v1(68.58,46.88) v1(68.58,46.19) v1(68.65,76.63) v1(68.65,75.87) v1(69.34,76.63) v1(69.34,75.87) v1(69.34,70.88) v1(69.34,70.19) v1(69.34,64.02) v1(69.34,63.33) v1(69.34,58.81) v1(69.34,58.13) v1(69.34,46.88) v1(69.34,46.19) v1(70.8,75.66) v1(70.8,70.56) v1(70.8,63.66) v1(70.8,58.56) v1(70.8,51.66) v1(70.8,46.56) v1(70.87,68.63) v1(70.87,67.94) v1(70.87,67.26) v1(70.87,66.53) v1(70.87,65.84) v1(70.87,56.44) v1(70.87,55.75) v1(70.87,55.06) v1(70.87,54.33) v1(70.87,53.65) v1(71.49,75.66) v1(71.49,70.56) v1(71.49,63.66) v1(71.49,58.56) v1(71.49,51.66) v1(71.49,46.56) v1(71.63,68.63) v1(71.63,67.94) v1(71.63,67.26) v1(71.63,66.53) v1(71.63,65.84) v1(71.63,56.44) v1(71.63,55.75) v1(71.63,55.06) v1(71.63,54.33) v1(71.63,53.65)
AVDD: length 15.6
  Top Layer w0.203: U15.32 40.98,50.19 v1(40.99,50.19) ; U11.3 v1(61.72,62.61) ; v1(40.52,50.57) 40.52,50.44 U15.33 ; U14.3 v1(61.72,51.91) ; U9.3 v1(61.72,73.29)
  Bottom Layer w0.203: R70.2 61.39,50.85 arc(61.5,51) C65.2 arc(61.67,51.4) 61.72,51.64 v1(61.72,51.91) ; v1(61.72,62.61) 61.72,62.34 arc(61.67,62.09) C52.2 arc(61.5,61.7) 61.39,61.55 R53.2 ; v1(61.72,73.29) 61.72,73.02 arc(61.67,72.78) C47.2 arc(61.5,72.39) 61.39,72.23 R44.2
  vias: v1(39.1,51.98) v1(48.56,74.12) v1(48.57,73.46) v1(49.38,74.12) v1(49.39,73.46) v1(50.19,74.12) v1(50.2,73.46) v1(51.01,74.12) v1(51.02,73.46)
DVDD: length 39
  Top Layer w0.203: v1(56.6,41.24) 56.59,41.25 U1.8 ; U15.95 33.93,30.42 v1(34.05,30.42) ; 34.93,49.87 36.06,48.74 v1(36.06,48.7) ; v1(31.45,44.17) 30.34,45.27 U15.52 ; v1(45.26,31.75) 45.27,31.75 U15.131 ; v1(48.02,38.8) 48.02,38.85 U15.6 ; v1(39.51,47.31) 40.66,48.45 40.66,48.46 ; v1(42.18,29.4) 41.78,29.01 41.78,28.17 U15.121 ; U15.17 44.13,42.74 v1(44.08,42.74) ; U15.62 27.93,40.61 v1(27.93,40.58) ; v1(24.37,37.02) 24.37,37.09 U15.72 ; U15.144 49.89,36.32 v1(49.83,36.32) ; v1(30.66,34.9) 30.63,34.9 27.15,31.41 ; U15.108 36.8,21.77 43.29,21.77 v1(43.8,22.28)
  Bottom Layer w0.203: v1(49.83,36.32) 49.68,36.17 R8.2
  vias: v1(35.57,74.12) v1(35.58,73.46) v1(36.39,74.12) v1(36.4,73.46) v1(37.2,74.12) v1(37.21,73.46) v1(38.02,74.12) v1(38.03,73.46) v1(39.5,61.17) v1(39.5,60.5) v1(64.78,22.48)
GND: length 110.3
  Top Layer w0.191: 38.35,60.63 38.7,60.97 38.7,62.09
  Top Layer w0.203: 43.94,31.29 v1(44.35,31.29) 45.02,31.29 U15.130 ; v1(16.2,70.65) v1(16.2,70.04) 16.2,69.57 16.38,69.39 v1(16.51,69.39) 16.96,69.39 v1(17.19,69.16) v1(17.84,68.5) v1(17.84,67.75) v1(17.84,67.12) v1(17.84,66.34) v1(17.84,65.65) v1(17.84,64.92) v1(17.84,64.25) v1(17.4,63.81) v1(16.62,63.81) 15.82,63.81 ; 44.58,23.16 44.58,25.07 43.69,25.96 43.28,25.96 42.42,26.82 ; 33.02,43.1 33.02,43.29 U15.51 ; v1(48.72,42.31) v1(49.29,42.89) v1(49.88,43.47) v1(50.44,44.03) v1(50.44,44.86) v1(50.44,45.54) C6.1 v1(50.44,46.3) v1(51.01,46.87) v1(51.57,47.43) v1(52.13,47.99) v1(52.71,48.56) 53.09,48.56 v1(53.33,48.32) v1(53.88,47.77) v1(54.4,47.26) v1(54.95,46.7) v1(55.55,46.11) 55.88,45.77 v1(55.88,45.42) v1(55.33,44.86) v1(54.83,44.37) v1(54.19,43.72) v1(53.59,43.12) v1(52.75,43.12) v1(51.85,43.12) 51.52,43.12 v1(51.24,42.85) v1(50.81,42.41) v1(50.26,41.86) v1(49.71,41.31) ; 33.91,51.61 v1(33.91,51.6) U15.38 ; 15.82,63.81 v1(15.84,63.82) ; 15.82,63.81 v1(15.1,63.81) v1(14.4,63.81) v1(13.73,63.81) 13.46,63.81 v1(13.14,64.12) v1(13.14,64.85) v1(13.14,65.64) v1(13.14,66.35) v1(13.14,67.14) v1(13.14,67.96) 13.14,68.63 v1(13.46,68.95) 13.91,69.39 v1(14,69.39) 14.61,69.39 v1(14.67,69.46) 14.8,69.59 v1(14.8,70.13) v1(14.8,70.74) ; 18.8,78.16 19.01,78.37 U3.23 ; 27.69,33.71 27.69,32.66 U15.83 ; C23.2 34.48,22.49 U15.107 ; U3.20 18.55,76.87 18.54,76.89 ; 25.27,43.99 25.27,43.97 27.15,42.09 ; v1(44.55,48.75) 45.1,49.3 v1(45.1,49.88) v1(45.1,50.67) v1(45.1,51.35) 45.1,51.47 v1(45.62,52) v1(46.21,52.58) 46.72,53.09 v1(46.72,53.11) 46.74,53.11 v1(47.27,53.64) v1(47.84,54.22) v1(48.29,54.66) 48.77,54.66 v1(49.04,54.39) v1(49.57,53.86) v1(50.06,53.37) v1(50.51,52.92) v1(50.97,52.46) v1(51.56,51.87) 51.56,51.36 v1(51.38,51.18) v1(50.86,50.66) v1(50.26,50.05) v1(49.82,49.62) v1(49.3,49.09) v1(48.83,48.62) 48.53,48.32 v1(48.25,48.32) v1(47.53,48.32) v1(46.82,48.32) 46.11,48.32 v1(46.05,48.26) v1(45.52,47.73) v1(45.07,47.28) v1(44.6,46.81) ; U15.94 31.62,28.82 31.62,30.28 ; 44.54,48.75 v1(44.05,48.25) v1(43.6,47.8) ; 45.6,43.51 43.8,41.71 43.56,41.71 ; U3.35 13.75,78.41 ; FPC1.1 v1(35.25,60.5) ; U3.47 14.1,73.87 ; FPC1.3 v1(36.25,60.5) ; U3.8 16.76,71.89 16.76,73.71
  Top Layer w0.381: v1(17.14,84.74) 17.21,84.68 19.46,84.68 v1(19.81,85.03)
  Bottom Layer w0.203: v1(30.73,40.82) 29.35,39.43 C14.1 ; 38.35,47.8 38.85,48.3 C11.1
  vias: v1(1.91,91.11) v1(1.91,89.84) v1(1.91,88.57) v1(1.91,87.3) v1(1.91,86.03) v1(1.91,84.76) v1(2.16,73.08) v1(2.16,71.81) v1(2.16,70.54) v1(2.16,69.27) v1(2.16,68) v1(2.16,66.73) v1(2.16,40.56) v1(2.16,39.29) v1(2.16,38.02) v1(2.16,36.75) v1(2.16,35.48) v1(2.16,34.21) v1(2.17,28.88) v1(2.17,27.61) v1(2.17,26.34) v1(2.21,20.24) v1(2.21,18.97) v1(2.21,17.7) v1(2.17,11.61) v1(2.17,10.34) v1(2.17,9.07) v1(6.86,84.09) v1(6.86,67.11) v1(6.97,80.19) v1(9.53,85.78) v1(9.91,67.02) v1(11.44,67.02) v1(12.54,85.9) v1(12.54,85.14) v1(13.37,85.9) v1(13.37,85.14) v1(15.18,77.24) v1(15.18,76.48) v1(15.18,75.72) v1(15.18,74.96) v1(16,77.24) v1(16,76.48) v1(16,75.72) v1(16,74.96) v1(16.83,77.24) v1(16.83,76.48) v1(16.83,75.72) v1(16.83,74.96) v1(17.14,84.06) v1(17.14,83.25) v1(17.14,82.31) v1(20.52,25.98) v1(20.52,21.05) v1(20.83,83.24) v1(21.34,82.73) v1(21.72,77.14) v1(21.92,37.76) v1(22.14,37.19) v1(22.62,37.97) v1(22.7,28.12) v1(22.7,27.36) v1(22.96,37.19) v1(23.37,82.09) v1(23.53,28.12) v1(23.53,27.36) v1(25.31,74.09) v1(25.29,43.98) v1(27.6,37.01) v1(27.91,47.93) v1(27.91,47.17) v1(28.22,37.61) v1(28.45,77.84) v1(28.45,73.39) v1(28.73,47.93) v1(28.73,47.17) v1(28.83,86.92) v1(28.83,86.22) v1(28.83,85.28) v1(29.59,80.44) v1(31.72,33.81) v1(31.72,33.05) v1(32.47,33.8) v1(32.48,33.07) v1(32.92,32.01) v1(33.47,46.02) v1(33.49,31.53) v1(33.68,28.84) v1(34.13,43.99) v1(34.13,43.23) v1(34.87,79.5) v1(34.87,78.73) v1(34.96,43.99) v1(35.7,79.5) v1(35.7,78.73) v1(36.32,78.66) v1(36.32,77.9) v1(37.21,97.84) v1(37.18,78.66) v1(37.18,77.9) v1(37.34,60.5) v1(38,78.66) v1(38,77.9) v1(38.48,97.84) v1(38.55,47.99) v1(38.64,44.88) v1(38.74,43.1) v1(38.67,20.94) v1(38.78,38.93) v1(38.86,35.36) v1(38.96,79.55) v1(38.96,78.79) v1(39.75,97.84) v1(39.78,79.55) v1(39.78,78.79) v1(40.62,63.2) v1(40.62,62.44) v1(40.61,61.77) v1(40.61,61.01) v1(40.56,20.94) v1(41.02,97.84) v1(41.44,63.2) v1(41.44,62.44) v1(41.43,61.77) v1(41.43,61.01) v1(41.62,60.38) v1(41.62,59.61) v1(41.92,30.59) v1(42.13,42.47) v1(42.24,41.77) v1(42.29,97.84) v1(42.45,60.38) v1(42.45,59.61) v1(42.39,36.37) v1(42.39,35.61) v1(42.64,30.89) v1(42.8,65.33) v1(42.8,64.57) v1(42.96,42.47) v1(42.96,41.71) v1(43.09,36.25) v1(43.21,35.61) v1(43.53,32.06) v1(43.56,97.84) v1(43.86,21.04) v1(44.35,32.06) v1(44.52,23.42) v1(44.83,97.84) v1(44.99,49.19) v1(45.29,23.42) v1(46.1,97.84) v1(47.16,44.71) v1(47.37,97.84) v1(47.66,44.33) v1(48.64,97.84) v1(49.91,97.84) v1(50.81,40.92) v1(51.18,97.84) v1(52.42,35.1) v1(52.42,34.34) v1(53.25,35.1) v1(53.25,34.34) v1(53.31,36.5) v1(54.13,36.5) v1(55.9,39.66) v1(60.04,11.05) v1(60.04,10.29) v1(60.03,9.62) v1(60.03,8.86) v1(60.87,11.05) v1(60.87,10.29) v1(60.86,9.62) v1(60.86,8.86) v1(72.77,41.2) v1(72.77,39.93) v1(72.77,38.66) v1(72.77,37.39) v1(72.77,36.12) v1(72.77,34.85) v1(72.9,28.63) v1(72.9,27.36) v1(72.9,26.09) v1(72.9,24.82) v1(72.9,23.55) v1(72.9,22.28) v1(72.9,21.01) v1(72.9,19.74) v1(72.9,18.47) v1(72.9,17.2) v1(72.9,15.93) v1(72.9,14.66) v1(73.03,89.46) v1(73.03,88.19) v1(73.03,86.92) v1(73.03,85.65) v1(73.03,84.38) v1(73.03,83.11)
VCC_5V: length 3.8
  Top Layer w0.381: R37.2 40.26,83.24 38.86,84.63 C39.1
  vias: v1(6.32,29.48) v1(6.32,20.84) v1(6.32,12.2) v1(6.99,29.48) v1(6.99,20.84) v1(6.99,12.2) v1(23.5,87.39) v1(29.06,75.76) v1(29.54,76.48) v1(29.88,75.76) v1(30.2,77.13) v1(30.36,76.48) v1(31.02,77.13) v1(32.12,87.53) v1(32.94,87.53) v1(33.4,86.57) v1(33.4,85.75) v1(33.75,87.53) v1(34.57,87.53) v1(35.39,87.53) v1(36.21,87.53) v1(37.02,87.53) v1(36.97,86.92) v1(37.08,86.18) v1(37.08,85.37) v1(37.84,87.53) v1(37.79,86.92) v1(38.61,86.92) v1(38.66,87.53) v1(39.43,86.92) v1(39.47,87.53) v1(42.05,75.76) v1(42.53,76.48) v1(42.87,75.76) v1(43.19,77.13) v1(43.34,76.48) v1(44.01,77.13) v1(53.21,94.63) v1(64.57,4.41)
VCC_IN: length 13.9
  Top Layer w0.203: v1(67,83.42) 67,82.91 67.32,82.59 R36.2
  Bottom Layer w0.203: v1(56.38,81.71) 65.29,81.71 v1(67,83.42)
ADC1_INN16: length 31.7
  Top Layer w0.203: C49.2 R47.2 57.03,72.57 arc(56.53,72.47) 56.11,72.19 arc(55.91,72.06) 55.68,72.01 arc(50.37,68.95) 47.24,63.68 arc(44.34,56.92) 39.84,51.11 39.69,50.96 arc(39.66,50.94) 39.63,50.93 arc(39.6,50.93) 39.57,50.91 U15.35
ADC1_INP16: length 31.4
  Top Layer w0.203: C51.2 R50.2 57.03,71.04 arc(56.53,71.14) 56.11,71.42 arc(55.91,71.56) 55.68,71.6 arc(50.62,68.62) 47.63,63.57 arc(44.69,56.72) 40.13,50.83 39.97,50.67 arc(39.96,50.64) 39.95,50.61 arc(39.94,50.58) 39.93,50.56 39.24,49.87
ADC2_INN10: length 24.6
  Top Layer w0.203: C67.2 R73.2 57.03,51.2 arc(56.53,51.11) 56.11,50.83 arc(55.91,50.69) 55.68,50.65 arc(54.05,51.46) 53.09,53.01 arc(52.42,54.27) 51.31,55.17 arc(45.79,54.89) 43.31,49.96 arc(43.17,49.05) 42.67,48.28 42.51,48.13 arc(42.49,48.11) 42.46,48.1 arc(42.43,48.1) 42.4,48.08 U15.27
ADC2_INP10: length 24.2
  Top Layer w0.203: 42.07,47.04 42.75,47.73 arc(42.77,47.75) 42.78,47.78 arc(42.78,47.81) 42.8,47.84 42.96,48 arc(43.55,48.91) 43.71,49.99 arc(46.01,54.55) 51.12,54.81 arc(52.11,54.01) 52.7,52.9 arc(53.8,51.14) 55.68,50.24 arc(55.91,50.19) 56.11,50.06 arc(56.53,49.78) 57.03,49.68 R76.2 C69.2
ADC3_INN1: length 24.3
  Top Layer w0.203: U15.28 42.05,48.44 arc(42.06,48.46) 42.07,48.49 arc(42.08,48.52) 42.09,48.55 42.25,48.7 arc(42.56,49.15) 42.7,49.68 arc(43.16,52.02) 44.16,54.19 arc(49.08,58.99) 55.68,60.91 arc(55.91,60.86) 56.11,60.73 arc(56.53,60.45) 57.03,60.35 R63.2 C60.2
ADC3_INP1: length 24.7
  Top Layer w0.203: U15.29 41.69,48.79 arc(41.72,48.81) 41.75,48.81 arc(41.78,48.82) 41.81,48.83 41.96,48.99 arc(42.19,49.32) 42.29,49.71 arc(42.77,52.15) 43.81,54.41 arc(48.88,59.34) 55.68,61.31 arc(55.91,61.36) 56.11,61.49 arc(56.53,61.77) 57.03,61.87 R56.2 C54.2
ADC_CLK: length 72.9
  Top Layer w0.158: U8.18 40,5.67 40,8.35 39.28,9.07 29.46,9.07 16.89,21.64 16.89,40.56 26.67,50.34 29.51,50.34 U15.46
BOOT0: length 28.7
  Top Layer w0.102: U15.138 48.79,33.18 49.87,32.1 52.95,32.1 61.6,23.44 66.65,23.44 66.93,23.16 SW1.4 66.93,21.64 66.68,21.39 63.88,21.39 63.35,21.92 R1.1
DA0: length 45
  Top Layer w0.158: U15.114 v2(42.34,22.66)
  Bottom Layer w0.158: U8.20 37.47,5.67 37.47,9.17 arc(37.53,9.33) 37.7,9.4 37.92,9.4 arc(38.15,9.64) 37.92,9.87 37.01,9.87 arc(36.78,10.11) 37.01,10.35 37.92,10.35 arc(38.15,10.58) 37.92,10.82 37.01,10.82 arc(36.78,11.06) 37.01,11.29 37.92,11.29 arc(38.15,11.53) 37.92,11.76 37.01,11.76 arc(36.78,12) 37.01,12.24 37.92,12.24 arc(38.15,12.47) 37.92,12.71 37.01,12.71 arc(36.78,12.95) 37.01,13.18 37.92,13.18 arc(38.15,13.42) 37.92,13.65 37.01,13.65 arc(36.78,13.89) 37.01,14.13 37.92,14.13 arc(38.15,14.36) 37.92,14.6 37.01,14.6 arc(36.78,14.84) 37.01,15.07 37.92,15.07 arc(38.15,15.31) 37.92,15.54 37.7,15.54 arc(37.53,15.61) 37.47,15.78 37.47,24.79 37.92,25.25 39.75,25.25 v2(42.34,22.66)
DA1: length 45.1
  Top Layer w0.158: 40.66,25.05 v2(42.29,23.42)
  Bottom Layer w0.158: 36.23,6.91 36.23,15.91 arc(36.16,16.08) 35.99,16.15 35.96,16.15 arc(35.73,16.39) 35.96,16.62 36.71,16.62 arc(36.94,16.86) 36.71,17.09 35.75,17.09 arc(35.51,17.33) 35.75,17.57 36.71,17.57 arc(36.95,17.8) 36.71,18.04 35.75,18.04 arc(35.51,18.28) 35.75,18.51 36.71,18.51 arc(36.95,18.75) 36.71,18.98 35.75,18.98 arc(35.51,19.22) 35.75,19.46 36.71,19.46 arc(36.94,19.69) 36.71,19.93 35.75,19.93 arc(35.51,20.17) 35.75,20.4 36.71,20.4 arc(36.94,20.64) 36.71,20.87 35.75,20.87 arc(35.51,21.11) 35.75,21.35 36.71,21.35 arc(36.94,21.58) 36.71,21.82 35.75,21.82 arc(35.51,22.06) 35.75,22.29 36.71,22.29 arc(36.95,22.53) 36.71,22.76 35.75,22.76 arc(35.51,23) 35.75,23.24 35.99,23.24 arc(36.16,23.31) 36.23,23.47 36.23,24.27 37.72,25.75 39.95,25.75 v2(42.29,23.42)
DA2: length 45.1
  Top Layer w0.158: U15.116 v2(43.05,23.36)
  Bottom Layer w0.158: v2(43.05,23.36) 40.16,26.25 37.51,26.25 34.93,23.67 34.93,15.51 arc(34.99,15.35) 35.16,15.28 35.22,15.28 arc(35.45,15.04) 35.22,14.8 34.59,14.8 arc(34.35,14.57) 34.59,14.33 35.26,14.33 arc(35.5,14.09) 35.26,13.86 34.59,13.86 arc(34.35,13.62) 34.59,13.39 35.26,13.39 arc(35.5,13.15) 35.26,12.91 34.59,12.91 arc(34.35,12.68) 34.59,12.44 35.26,12.44 arc(35.5,12.21) 35.26,11.97 34.59,11.97 arc(34.35,11.73) 34.59,11.5 35.26,11.5 arc(35.5,11.26) 35.26,11.02 34.59,11.02 arc(34.35,10.79) 34.59,10.55 35.26,10.55 arc(35.5,10.31) 35.26,10.08 34.59,10.08 arc(34.35,9.84) 34.59,9.61 35.26,9.61 arc(35.5,9.37) 35.26,9.13 35.16,9.13 arc(34.99,9.06) 34.93,8.9 34.93,5.67 U8.22
DA3: length 45.1
  Top Layer w0.158: U15.117 v2(43,24.12)
  Bottom Layer w0.158: v2(43,24.12) 40.37,26.75 37.3,26.75 33.69,23.14 33.69,22.4 arc(33.76,22.23) 33.93,22.16 34.09,22.16 arc(34.33,21.93) 34.09,21.69 33.29,21.69 arc(33.05,21.45) 33.29,21.22 34.09,21.22 arc(34.33,20.98) 34.09,20.75 33.29,20.75 arc(33.05,20.51) 33.29,20.27 34.09,20.27 arc(34.33,20.04) 34.09,19.8 33.29,19.8 arc(33.05,19.56) 33.29,19.33 34.09,19.33 arc(34.33,19.09) 34.09,18.86 33.29,18.86 arc(33.05,18.62) 33.29,18.38 34.09,18.38 arc(34.33,18.15) 34.09,17.91 33.29,17.91 arc(33.05,17.68) 33.29,17.44 34.09,17.44 arc(34.33,17.2) 34.09,16.97 33.29,16.97 arc(33.05,16.73) 33.29,16.49 34.09,16.49 arc(34.33,16.26) 34.09,16.02 33.36,16.02 arc(33.12,15.79) 33.36,15.55 33.45,15.55 arc(33.62,15.48) 33.69,15.31 33.69,6.91
DA4: length 45
  Top Layer w0.158: U15.118 v2(43.76,24.07)
  Bottom Layer w0.158: U8.24 32.38,5.67 32.38,8.5 arc(32.45,8.66) 32.6,8.72 arc(32.76,8.79) 32.82,8.94 32.82,8.98 arc(32.76,9.13) 32.6,9.2 32.16,9.2 arc(32.01,9.26) 31.95,9.42 31.95,9.45 arc(32.01,9.61) 32.16,9.67 32.6,9.67 arc(32.76,9.73) 32.82,9.89 32.82,9.92 arc(32.76,10.08) 32.6,10.14 32.16,10.14 arc(32.01,10.21) 31.95,10.36 31.95,10.4 arc(32.01,10.55) 32.16,10.61 32.6,10.61 arc(32.76,10.68) 32.82,10.83 32.82,10.87 arc(32.76,11.02) 32.6,11.09 32.16,11.09 arc(32.01,11.15) 31.95,11.31 31.95,11.34 arc(32.01,11.5) 32.16,11.56 32.6,11.56 arc(32.76,11.62) 32.82,11.78 32.82,11.81 arc(32.76,11.97) 32.6,12.03 32.16,12.03 arc(32.01,12.1) 31.95,12.25 31.95,12.28 arc(32.01,12.44) 32.16,12.5 32.6,12.5 arc(32.76,12.57) 32.82,12.72 32.82,12.76 arc(32.76,12.91) 32.6,12.98 32.16,12.98 arc(32.01,13.04) 31.95,13.2 31.95,13.23 arc(32.01,13.38) 32.16,13.45 32.6,13.45 arc(32.76,13.51) 32.82,13.67 32.82,13.7 arc(32.76,13.86) 32.6,13.92 32.16,13.92 arc(32.01,13.99) 31.95,14.14 31.95,14.17 arc(32.01,14.33) 32.16,14.39 32.6,14.39 arc(32.76,14.46) 32.82,14.61 32.82,14.65 arc(32.76,14.8) 32.6,14.87 arc(32.45,14.93) 32.38,15.09 32.38,22.54 37.09,27.25 40.57,27.25 v2(43.76,24.07)
DA5: length 45
  Top Layer w0.158: 42.07,26.47 v2(43.7,24.83)
  Bottom Layer w0.158: 31.15,6.91 31.15,14.85 arc(31.22,15.02) 31.39,15.09 arc(31.62,15.33) 31.39,15.56 30.83,15.56 arc(30.59,15.8) 30.83,16.04 31.47,16.04 arc(31.71,16.27) 31.47,16.51 30.83,16.51 arc(30.59,16.74) 30.83,16.98 31.47,16.98 arc(31.71,17.22) 31.47,17.45 30.83,17.45 arc(30.59,17.69) 30.83,17.93 31.47,17.93 arc(31.71,18.16) 31.47,18.4 30.83,18.4 arc(30.59,18.63) 30.83,18.87 31.47,18.87 arc(31.71,19.11) 31.47,19.34 30.83,19.34 arc(30.59,19.58) 30.83,19.81 31.47,19.81 arc(31.71,20.05) 31.47,20.29 30.83,20.29 arc(30.59,20.52) 30.83,20.76 31.47,20.76 arc(31.71,21) 31.47,21.23 31.39,21.23 arc(31.22,21.3) 31.15,21.47 31.15,22.01 36.89,27.75 40.78,27.75 v2(43.7,24.83)
DA6: length 45.1
  Top Layer w0.158: v2(45.21,24.57) 45.21,25.44 U15.122
  Bottom Layer w0.158: U8.26 29.84,5.67 29.84,8.23 arc(29.91,8.38) 30.06,8.44 arc(30.22,8.51) 30.28,8.66 30.28,8.7 arc(30.22,8.85) 30.06,8.92 29.62,8.92 arc(29.47,8.98) 29.41,9.14 29.41,9.17 arc(29.47,9.33) 29.62,9.39 30.06,9.39 arc(30.22,9.45) 30.28,9.61 30.28,9.64 arc(30.22,9.8) 30.06,9.86 29.62,9.86 arc(29.47,9.93) 29.41,10.08 29.41,10.12 arc(29.47,10.27) 29.62,10.34 30.06,10.34 arc(30.22,10.4) 30.28,10.56 30.28,10.59 arc(30.22,10.74) 30.06,10.81 29.62,10.81 arc(29.47,10.87) 29.41,11.03 29.42,11.04 29.41,11.06 arc(29.47,11.22) 29.62,11.28 arc(29.78,11.34) 29.84,11.5 29.84,21.42 36.68,28.25 40.99,28.25 44.67,24.57 v2(45.21,24.57)
DA7: length 45.1
  Top Layer w0.158: v2(45.71,25.08) 45.71,25.65 U15.123
  Bottom Layer w0.158: v2(45.71,25.08) 44.87,25.08 41.2,28.75 36.47,28.75 28.61,20.89 28.61,19.62 arc(28.68,19.45) 28.85,19.38 28.88,19.38 arc(29.12,19.15) 28.88,18.91 28.34,18.91 arc(28.1,18.68) 28.34,18.44 28.88,18.44 arc(29.12,18.2) 28.88,17.97 28.34,17.97 arc(28.11,17.73) 28.34,17.49 28.88,17.49 arc(29.11,17.26) 28.88,17.02 28.34,17.02 arc(28.11,16.79) 28.34,16.55 28.92,16.55 arc(29.15,16.31) 28.92,16.08 28.85,16.08 arc(28.68,16.01) 28.61,15.84 28.61,6.91
DA8: length 45.2
  Top Layer w0.158: U15.77 v2(22.35,31.57)
  Bottom Layer w0.158: v2(22.35,31.57) 24.7,33.92 29.51,33.92 32.82,30.6 32.82,25.85 27.31,20.34 27.31,5.67 U8.28
DA9: length 45
  Top Layer w0.158: U15.78 v2(23.14,31.65)
  Bottom Layer w0.158: v2(23.14,31.65) 24.91,33.42 29.3,33.42 32.32,30.4 32.32,26.06 26.07,19.81 26.07,17.17 arc(26.14,17.01) 26.31,16.94 26.38,16.94 arc(26.62,16.7) 26.38,16.47 25.76,16.47 arc(25.52,16.23) 25.76,15.99 26.38,15.99 arc(26.62,15.76) 26.38,15.52 25.76,15.52 arc(25.52,15.28) 25.76,15.05 26.38,15.05 arc(26.62,14.81) 26.38,14.58 25.76,14.58 arc(25.53,14.34) 25.76,14.1 25.83,14.1 arc(26,14.03) 26.07,13.87 26.07,6.91
DA10: length 45
  Top Layer w0.158: U15.79 v2(23.06,30.86)
  Bottom Layer w0.158: v2(23.06,30.86) 25.11,32.92 29.09,32.92 31.82,30.19 31.82,26.27 24.76,19.21 24.76,12.61 arc(24.83,12.45) 25,12.38 25.12,12.38 arc(25.35,12.14) 25.12,11.9 24.41,11.9 arc(24.18,11.67) 24.41,11.43 24.53,11.43 arc(24.7,11.36) 24.76,11.2 24.76,5.67 U8.30
DA11: length 45.2
  Top Layer w0.158: 25.74,32.83 v2(23.85,30.94)
  Bottom Layer w0.158: v2(23.85,30.94) 25.32,32.42 28.89,32.42 31.32,29.98 31.32,26.47 23.53,18.68 23.53,17.45 arc(23.6,17.29) 23.77,17.22 23.85,17.22 arc(24.09,16.98) 23.85,16.74 23.21,16.74 arc(22.97,16.51) 23.21,16.27 23.85,16.27 arc(24.09,16.04) 23.85,15.8 23.21,15.8 arc(22.97,15.56) 23.21,15.33 23.85,15.33 arc(24.09,15.09) 23.85,14.85 23.21,14.85 arc(22.97,14.62) 23.21,14.38 23.85,14.38 arc(24.09,14.15) 23.85,13.91 23.21,13.91 arc(22.97,13.67) 23.21,13.44 23.29,13.44 arc(23.46,13.37) 23.53,13.2 23.53,6.91
DA12: length 45.1
  Top Layer w0.158: U15.81 v2(23.77,30.15)
  Bottom Layer w0.158: v2(23.77,30.15) 25.53,31.92 28.68,31.92 30.82,29.77 30.82,26.68 22.22,18.09 22.22,11.7 arc(22.29,11.53) 22.46,11.46 22.47,11.46 arc(22.71,11.22) 22.47,10.99 21.98,10.99 arc(21.74,10.75) 21.98,10.51 22.47,10.51 arc(22.71,10.28) 22.47,10.04 21.98,10.04 arc(21.74,9.81) 21.98,9.57 22.47,9.57 arc(22.71,9.33) 22.47,9.1 22.46,9.1 arc(22.29,9.03) 22.22,8.86 22.22,5.67 U8.32
DA13: length 45.1
  Top Layer w0.158: U15.82 v2(24.55,30.23)
  Bottom Layer w0.158: 20.99,6.91 20.99,11.85 arc(21.06,12.02) 21.23,12.09 21.29,12.09 arc(21.53,12.32) 21.29,12.56 20.61,12.56 arc(20.38,12.8) 20.61,13.03 21.37,13.03 arc(21.6,13.27) 21.37,13.5 20.61,13.5 arc(20.38,13.74) 20.61,13.98 21.37,13.98 arc(21.6,14.21) 21.37,14.45 20.61,14.45 arc(20.38,14.69) 20.61,14.92 21.37,14.92 arc(21.6,15.16) 21.37,15.39 20.61,15.39 arc(20.38,15.63) 20.61,15.87 21.37,15.87 arc(21.6,16.1) 21.37,16.34 21.23,16.34 arc(21.06,16.41) 20.99,16.58 20.99,17.56 30.32,26.89 30.32,29.57 28.47,31.42 25.74,31.42 v2(24.55,30.23)
DA14: length 45
  Top Layer w0.158: v2(24.38,28.63) 25.07,28.63 U15.85
  Bottom Layer w0.158: U8.34 19.69,5.67 19.69,8.58 arc(19.75,8.75) 19.92,8.82 19.94,8.82 arc(20.18,9.05) 19.94,9.29 19.43,9.29 arc(19.19,9.53) 19.43,9.76 19.94,9.76 arc(20.18,10) 19.94,10.24 19.43,10.24 arc(19.19,10.47) 19.43,10.71 19.94,10.71 arc(20.18,10.94) 19.94,11.18 19.92,11.18 arc(19.75,11.25) 19.69,11.42 19.69,16.96 29.82,27.1 29.82,29.36 28.26,30.92 25.94,30.92 24.38,29.36 v2(24.38,28.63)
DA15: length 45
  Top Layer w0.158: U15.86 25.27,28.13 v2(24.89,28.13)
  Bottom Layer w0.158: 18.45,6.91 18.45,11.39 arc(18.38,11.56) 18.21,11.62 18.09,11.62 arc(17.85,11.86) 18.09,12.1 18.81,12.1 arc(19.05,12.33) 18.81,12.57 18.09,12.57 arc(17.85,12.81) 18.09,13.04 18.81,13.04 arc(19.05,13.28) 18.81,13.51 18.09,13.51 arc(17.85,13.75) 18.09,13.99 18.81,13.99 arc(19.05,14.22) 18.81,14.46 18.09,14.46 arc(17.85,14.7) 18.09,14.93 18.81,14.93 arc(19.05,15.17) 18.81,15.4 18.69,15.4 arc(18.52,15.47) 18.45,15.64 18.45,16.43 29.32,27.3 29.32,29.15 28.06,30.42 26.15,30.42 24.89,29.16 v2(24.89,28.13)
DAC1_OUT1: length 16.6
  Top Layer w0.203: R69.1 24.44,58.6 arc(25.41,58.4) 26.24,57.85 U15.40
DAC1_OUT2: length 15.3
  Top Layer w0.203: R58.1 26.53,55.8 arc(27.5,55.61) 28.32,55.06 U15.41
DAC_CLK: length 68.9
  Top Layer w0.158: 41.31,6.91 41.31,7.76 39.5,9.57 29.67,9.57 17.39,21.85 17.39,40.36 26.88,49.84 29.3,49.84 32.1,47.04
DAOF: length 33.4
  Top Layer w0.158: U15.76 v1(22.43,32.36)
  Bottom Layer w0.158: v1(22.43,32.36) 21.34,31.26 21.34,20.12 17.14,15.93 17.14,5.67 U8.36
DB0: length 68.1
  Top Layer w0.158: U8.16 42.54,5.67 42.54,9.77 42.23,10.08 29.85,10.08 17.91,22.03 17.91,40.18 23.74,46.02 26.76,46.02 U15.56
DB1: length 68.2
  Top Layer w0.158: 43.85,6.91 43.85,10.31 42.77,11.39 32.02,11.39 arc(31.85,11.32) 31.78,11.15 31.78,10.79 arc(31.54,10.56) 31.31,10.79 31.31,11.59 arc(31.07,11.83) 30.84,11.59 30.84,10.79 arc(30.6,10.56) 30.36,10.79 30.36,11.15 arc(30.29,11.32) 30.13,11.39 29.26,11.39 18.41,22.24 18.41,39.98 23.95,45.52 26.55,45.52 28.56,43.51
DB2: length 68.1
  Top Layer w0.158: U15.87 21.83,23.98 21.83,19.5 28.71,12.62 35.06,12.62 arc(35.22,12.69) 35.29,12.86 35.29,13.22 arc(35.53,13.46) 35.77,13.22 35.77,12.1 arc(36,11.86) 36.24,12.1 36.24,13.22 arc(36.47,13.46) 36.71,13.22 36.71,12.1 arc(36.95,11.86) 37.18,12.1 37.18,13.22 arc(37.42,13.46) 37.66,13.22 37.66,12.1 arc(37.89,11.86) 38.13,12.1 38.13,13.22 arc(38.36,13.46) 38.6,13.22 38.6,12.1 arc(38.84,11.86) 39.07,12.1 39.07,13.22 arc(39.31,13.46) 39.55,13.22 39.55,12.1 arc(39.78,11.86) 40.02,12.1 40.02,13.22 arc(40.25,13.46) 40.49,13.22 40.49,12.1 arc(40.73,11.86) 40.96,12.1 40.96,13.22 arc(41.2,13.46) 41.44,13.22 41.44,12.1 arc(41.67,11.86) 41.91,12.1 41.91,13.22 arc(42.14,13.46) 42.38,13.22 42.38,12.86 arc(42.45,12.69) 42.62,12.62 43.28,12.62 45.09,10.82 45.09,5.67 U8.14
DB3: length 68.2
  Top Layer w0.158: 46.39,6.91 46.39,7.9 arc(46.32,8.06) 46.15,8.13 arc(45.92,8.37) 46.15,8.61 46.92,8.61 arc(47.15,8.84) 46.92,9.08 45.79,9.08 arc(45.56,9.31) 45.79,9.55 46.92,9.55 arc(47.15,9.79) 46.92,10.02 46.08,10.02 arc(45.84,10.26) 46.08,10.5 46.15,10.5 arc(46.32,10.57) 46.39,10.73 46.39,11.36 43.82,13.93 35.37,13.93 arc(35.2,14) 35.13,14.16 35.13,14.46 arc(34.9,14.69) 34.66,14.46 34.66,13.33 arc(34.43,13.1) 34.19,13.33 34.19,14.46 arc(33.95,14.69) 33.72,14.46 33.72,13.33 arc(33.48,13.1) 33.25,13.33 33.25,14.46 arc(33.01,14.69) 32.77,14.46 32.77,13.33 arc(32.54,13.1) 32.3,13.33 32.3,14.46 arc(32.06,14.69) 31.83,14.46 31.83,13.33 arc(31.59,13.1) 31.36,13.33 31.36,14.46 arc(31.12,14.69) 30.88,14.46 30.88,13.33 arc(30.65,13.1) 30.41,13.33 30.41,14.46 arc(30.17,14.69) 29.94,14.46 29.94,13.33 arc(29.7,13.1) 29.47,13.33 29.47,14.46 arc(29.23,14.69) 28.99,14.46 28.99,14.16 arc(28.92,14) 28.76,13.93 28.11,13.93 22.33,19.71 22.33,23.77 28.56,30
DB4: length 68.2
  Top Layer w0.158: U15.89 22.83,23.56 22.83,19.92 27.59,15.16 36.11,15.16 arc(36.28,15.1) 36.34,14.93 arc(36.58,14.69) 36.82,14.93 36.82,15.76 arc(37.05,16) 37.29,15.76 37.29,14.64 arc(37.53,14.4) 37.76,14.64 37.76,15.76 arc(38,16) 38.23,15.76 38.23,14.64 arc(38.47,14.4) 38.71,14.64 38.71,15.76 arc(38.94,16) 39.18,15.76 39.18,14.64 arc(39.41,14.4) 39.65,14.64 39.65,15.76 arc(39.89,16) 40.12,15.76 40.12,14.64 arc(40.36,14.4) 40.6,14.64 40.6,15.76 arc(40.83,16) 41.07,15.76 41.07,14.64 arc(41.31,14.4) 41.54,14.64 41.54,15.76 arc(41.78,16) 42.01,15.76 42.01,14.64 arc(42.25,14.4) 42.49,14.64 42.49,15.76 arc(42.72,16) 42.96,15.76 42.96,14.77 arc(43.19,14.54) 43.43,14.77 43.43,14.93 arc(43.5,15.09) 43.67,15.16 44.34,15.16 47.62,11.87 47.62,5.67 U8.12
